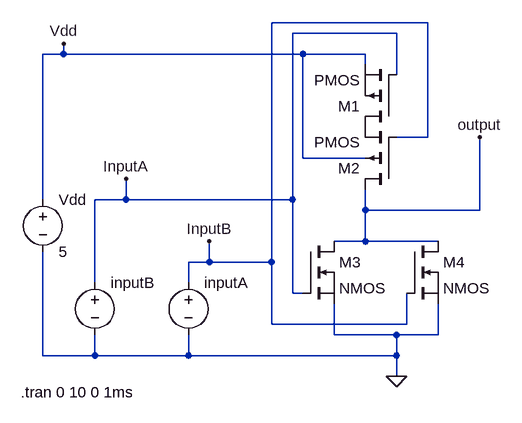
[diagram p0: schematic NorGate.asc]
NorGate.asc, the LTspice schematic file:
Version 4
SHEET 1 880 680
WIRE 192 -96 -48 -96
WIRE 144 -80 -16 -80
WIRE -368 -48 -368 -64
WIRE -368 -48 -400 -48
WIRE 0 -48 -368 -48
WIRE 96 -48 0 -48
WIRE 96 -32 96 -48
WIRE 144 -16 144 -80
WIRE 192 80 192 -96
WIRE 192 80 144 80
WIRE 0 112 0 -48
WIRE 96 112 0 112
WIRE -400 176 -400 -48
WIRE -272 176 -272 144
WIRE -272 176 -320 176
WIRE -16 176 -16 -80
WIRE -16 176 -272 176
WIRE 96 192 96 160
WIRE 272 192 272 80
WIRE 272 192 96 192
WIRE 96 240 96 192
WIRE 96 240 48 240
WIRE 208 240 96 240
WIRE -144 272 -144 240
WIRE -144 272 -176 272
WIRE -48 272 -48 -96
WIRE -48 272 -144 272
WIRE -320 304 -320 176
WIRE -176 304 -176 272
WIRE -16 320 -16 176
WIRE 0 320 -16 320
WIRE -48 368 -48 272
WIRE 160 368 160 320
WIRE 160 368 -48 368
WIRE 48 384 48 336
WIRE 144 384 48 384
WIRE 208 384 208 336
WIRE 208 384 144 384
WIRE -400 416 -400 256
WIRE -320 416 -320 384
WIRE -320 416 -400 416
WIRE -176 416 -176 384
WIRE -176 416 -320 416
WIRE 144 416 144 384
WIRE 144 416 -176 416
WIRE 144 448 144 416
FLAG 144 448 0
FLAG -368 -64 Vdd
FLAG -272 144 InputA
FLAG -144 240 InputB
FLAG 272 80 output
SYMBOL voltage -320 288 R0
WINDOW 123 0 0 Left 2
WINDOW 39 0 0 Left 2
WINDOW 3 24 96 Invisible 2
SYMATTR InstName inputB
SYMATTR Value PULSE(0 5 0 0 0 2 4)
SYMBOL voltage -400 160 R0
WINDOW 123 0 0 Left 2
WINDOW 39 0 0 Left 2
SYMATTR InstName Vdd
SYMATTR Value 5
SYMBOL voltage -176 288 R0
WINDOW 123 0 0 Left 2
WINDOW 39 0 0 Left 2
WINDOW 3 24 96 Invisible 2
SYMATTR InstName inputA
SYMATTR Value PULSE(0 5 0 0 0 1 2)
SYMBOL pmos 144 64 R180
SYMATTR InstName M1
SYMBOL pmos4 144 160 R180
SYMATTR InstName M2
SYMBOL nmos 0 240 R0
SYMATTR InstName M3
SYMBOL nmos 160 240 R0
SYMATTR InstName M4
TEXT -434 472 Left 2 !.tran 0 10 0 1ms

The netlist it stands for:
* NorGate.asc
V§inputB InputA 0 PULSE(0 5 0 0 0 2 4)
Vdd Vdd 0 5
V§inputA InputB 0 PULSE(0 5 0 0 0 1 2)
M1 P001 InputA Vdd Vdd PMOS
M2 output InputB P001 Vdd PMOS
M3 output InputA 0 0 NMOS
M4 output InputB 0 0 NMOS
.model NMOS NMOS
.model PMOS PMOS
.lib standard.mos
.tran 0 10 0 1ms
.backanno
.end

* Results of the author's LTspice run, read from the files saved beside the schematic
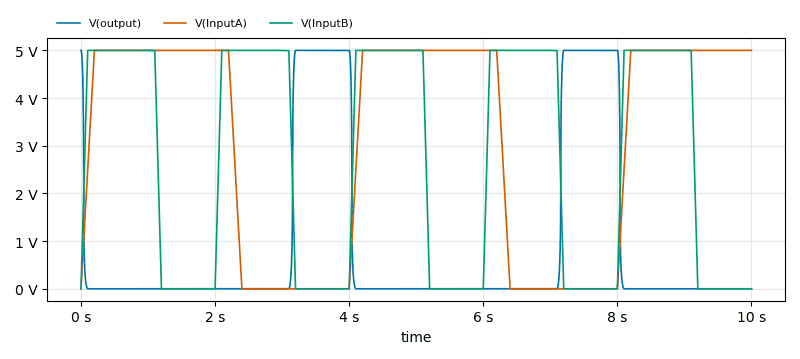
[diagram p1: Transient Analysis of NorGate.asc, plotted from the saved traces]
* Transient Analysis, 1 run:
*   V(output): min 0 V, max 5 V, average 903.6 mV, rms 2.106 V, last 0 V
*   V(InputA): min 0 V, max 5 V, average 3.15 V, rms 3.933 V, last 5 V
*   V(InputB): min 0 V, max 5 V, average 2.75 V, rms 3.66 V, last 0 V